# Altium schematic sheet MCU.SchDoc
size A; SheetNumber: 2; SheetTotal: 2
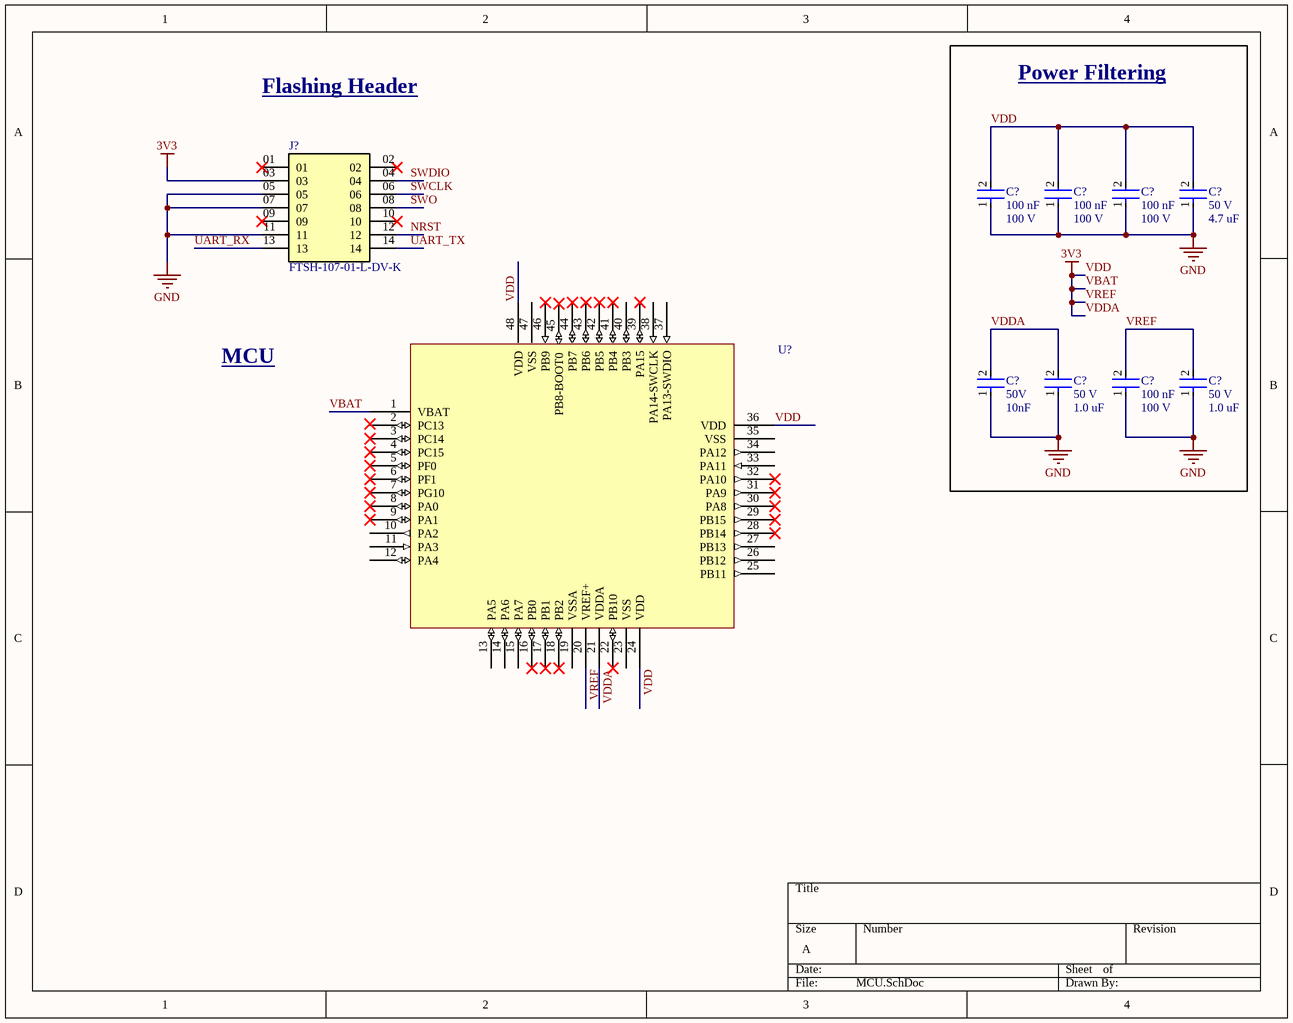
[diagram p0: MCU.SchDoc]

## Parts
(Parts that share a designator on the sheet are numbered #1, #2 ... from top to bottom, then left to right.)
C?#1  Capacitance: 100 nF  Voltage: 100 V  [CAP-0603]  (hidden comment: CC0603KRX7R0BB104)
C?#2  Capacitance: 100 nF  Voltage: 100 V  [CAP-0603]  (hidden comment: CC0603KRX7R0BB104)
C?#3  Capacitance: 100 nF  Voltage: 100 V  [CAP-0603]  (hidden comment: CC0603KRX7R0BB104)
C?#4  Voltage: 50 V  Capacitance: 4.7 uF  [CAP-0805]  (hidden comment: CC0805KKX5R9BB475)
C?#5  Voltage: 50V  Capacitance: 10nF  [CAP-0805]  (hidden comment: GRM2195C1H103JA01D)
C?#6  Voltage: 50 V  Capacitance: 1.0 uF  [CAP-0805]  (hidden comment: CC0805KKX7R9BB105)
C?#7  Capacitance: 100 nF  Voltage: 100 V  [CAP-0603]  (hidden comment: CC0603KRX7R0BB104)
C?#8  Voltage: 50 V  Capacitance: 1.0 uF  [CAP-0805]  (hidden comment: CC0805KKX7R9BB105)
J?  FTSH-107-01-L-DV-K  [SAMTEC_FTSH-107-01-L-DV-K]
U?  STM32G431CBT6  [IC-LQFP48]  (value not drawn)

## Blocks framed on the sheet
Power Filtering: C?#1-C?#8

## Nets
GND: C?#1.1 C?#2.1 C?#3.1 C?#4.1 C?#5.1 C?#6.1 C?#7.1 C?#8.1 J?.05 J?.07 J?.11
VBAT: C?#1.2 C?#2.2 C?#3.2 C?#4.2 C?#5.2 C?#6.2 C?#7.2 C?#8.2 J?.03 U?.1(VBAT) U?.20(VREF+) U?.21(VDDA) U?.24(VDD) U?.36(VDD) U?.48(VDD)  [also labelled 3V3, VDD, VDDA, VREF]
NRST: J?.12
SWCLK: J?.06
SWDIO: J?.04
SWO: J?.08
UART_RX: J?.13
UART_TX: J?.14

Not connected (* = marked no-connect by the designer): J? 01* 02* 09* 10*; U? 2(PC13) 3(PC14)* 4(PC15)* 5(PF0)* 6(PF1)* 7(PG10)* 8(PA0)* 9(PA1)* 10(PA2) 11(PA3) 12(PA4) 13(PA5) 14(PA6) 15(PA7) 16(PB0)* 17(PB1)* 18(PB2)* 19(VSSA) 22(PB10)* 23(VSS) 25(PB11) 26(PB12) 27(PB13) 28(PB14)* 29(PB15)* 30(PA8)* 31(PA9)* 32(PA10)* 33(PA11) 34(PA12) 35(VSS) 37(PA13-SWDIO) 38(PA14-SWCLK) 39(PA15)* 40(PB3) 41(PB4)* 42(PB5)* 43(PB6)* 44(PB7)* 45(PB8-BOOT0)* 46(PB9)* 47(VSS)

## Notes on the sheet
- Flashing Header
- MCU

## Library data of the parts
C?#1-C?#3 C?#7 = CAP-100N-0001: CAP CER 0.1UF 100V X7R 0603; Device Class: Ceramic; Size: 0603; ComponentLink1Description: Datasheet; ComponentLink1URL: https://www.yageo.com/upload/media/product/app/datasheet/mlcc/upy-np0x7r_mv_100-to-630v.pdf
C?#4 = CAP-4.7U-0002: CAP CER 4.7UF 50V X5R 0805; ComponentLink2Description: Datasheet; ComponentLink2URL: http://www.yageo.com/documents/recent/UPY-GPHC_Y5V_6.3V-to-50V_8.pdf; Device Class: Ceramic; Size: 0805
C?#5 = CAP-10N-0001: CAP CER 10000PF 50V C0G/NP0 0805; Device Class: Ceramic; Size: 0805; ComponentLink1Description: Datasheet; ComponentLink1URL: https://search.murata.co.jp/Ceramy/image/img/A01X/G101/ENG/GRM2195C1H103JA01-01.pdf
C?#6 C?#8 = CAP-1U-0001: CAP CER 1UF 50V X7R 0805; ComponentLink2URL: https://www.yageo.com/upload/media/product/productsearch/datasheet/mlcc/UPY-GPHC_X7R_6.3V-to-250V_24.pdf; ComponentLink2Description: Datasheet; Device Class: Ceramic; Size: 0805
J? = CONN_Flashing-0001: Connector Header Surface Mount 14 position 0.050" (1.27mm); MF: Samtec; Value: *; Price: None; Package: None; Availability: Unavailable; MP: FTSH-107-01-L-DV-K; ComponentLink1Description: Datasheet; ComponentLink1URL: https://mm.digikey.com/Volume0/opasdata/d220001/medias/docus/6209/ftsh-1xx-xx-xxx-dv-xxx-xxx-x-xx-mkt.pdf
U? = IC-STM32G431CBT6: IC MCU 32BIT 128KB FLASH 48LQFP; Package: 48LQFP; ComponentLink1Description: Datasheet; ComponentLink1URL: https://www.st.com/resource/en/datasheet/stm32g431cb.pdf